# Altium project Meu Arduino.PrjPcb (part 1 of 3)
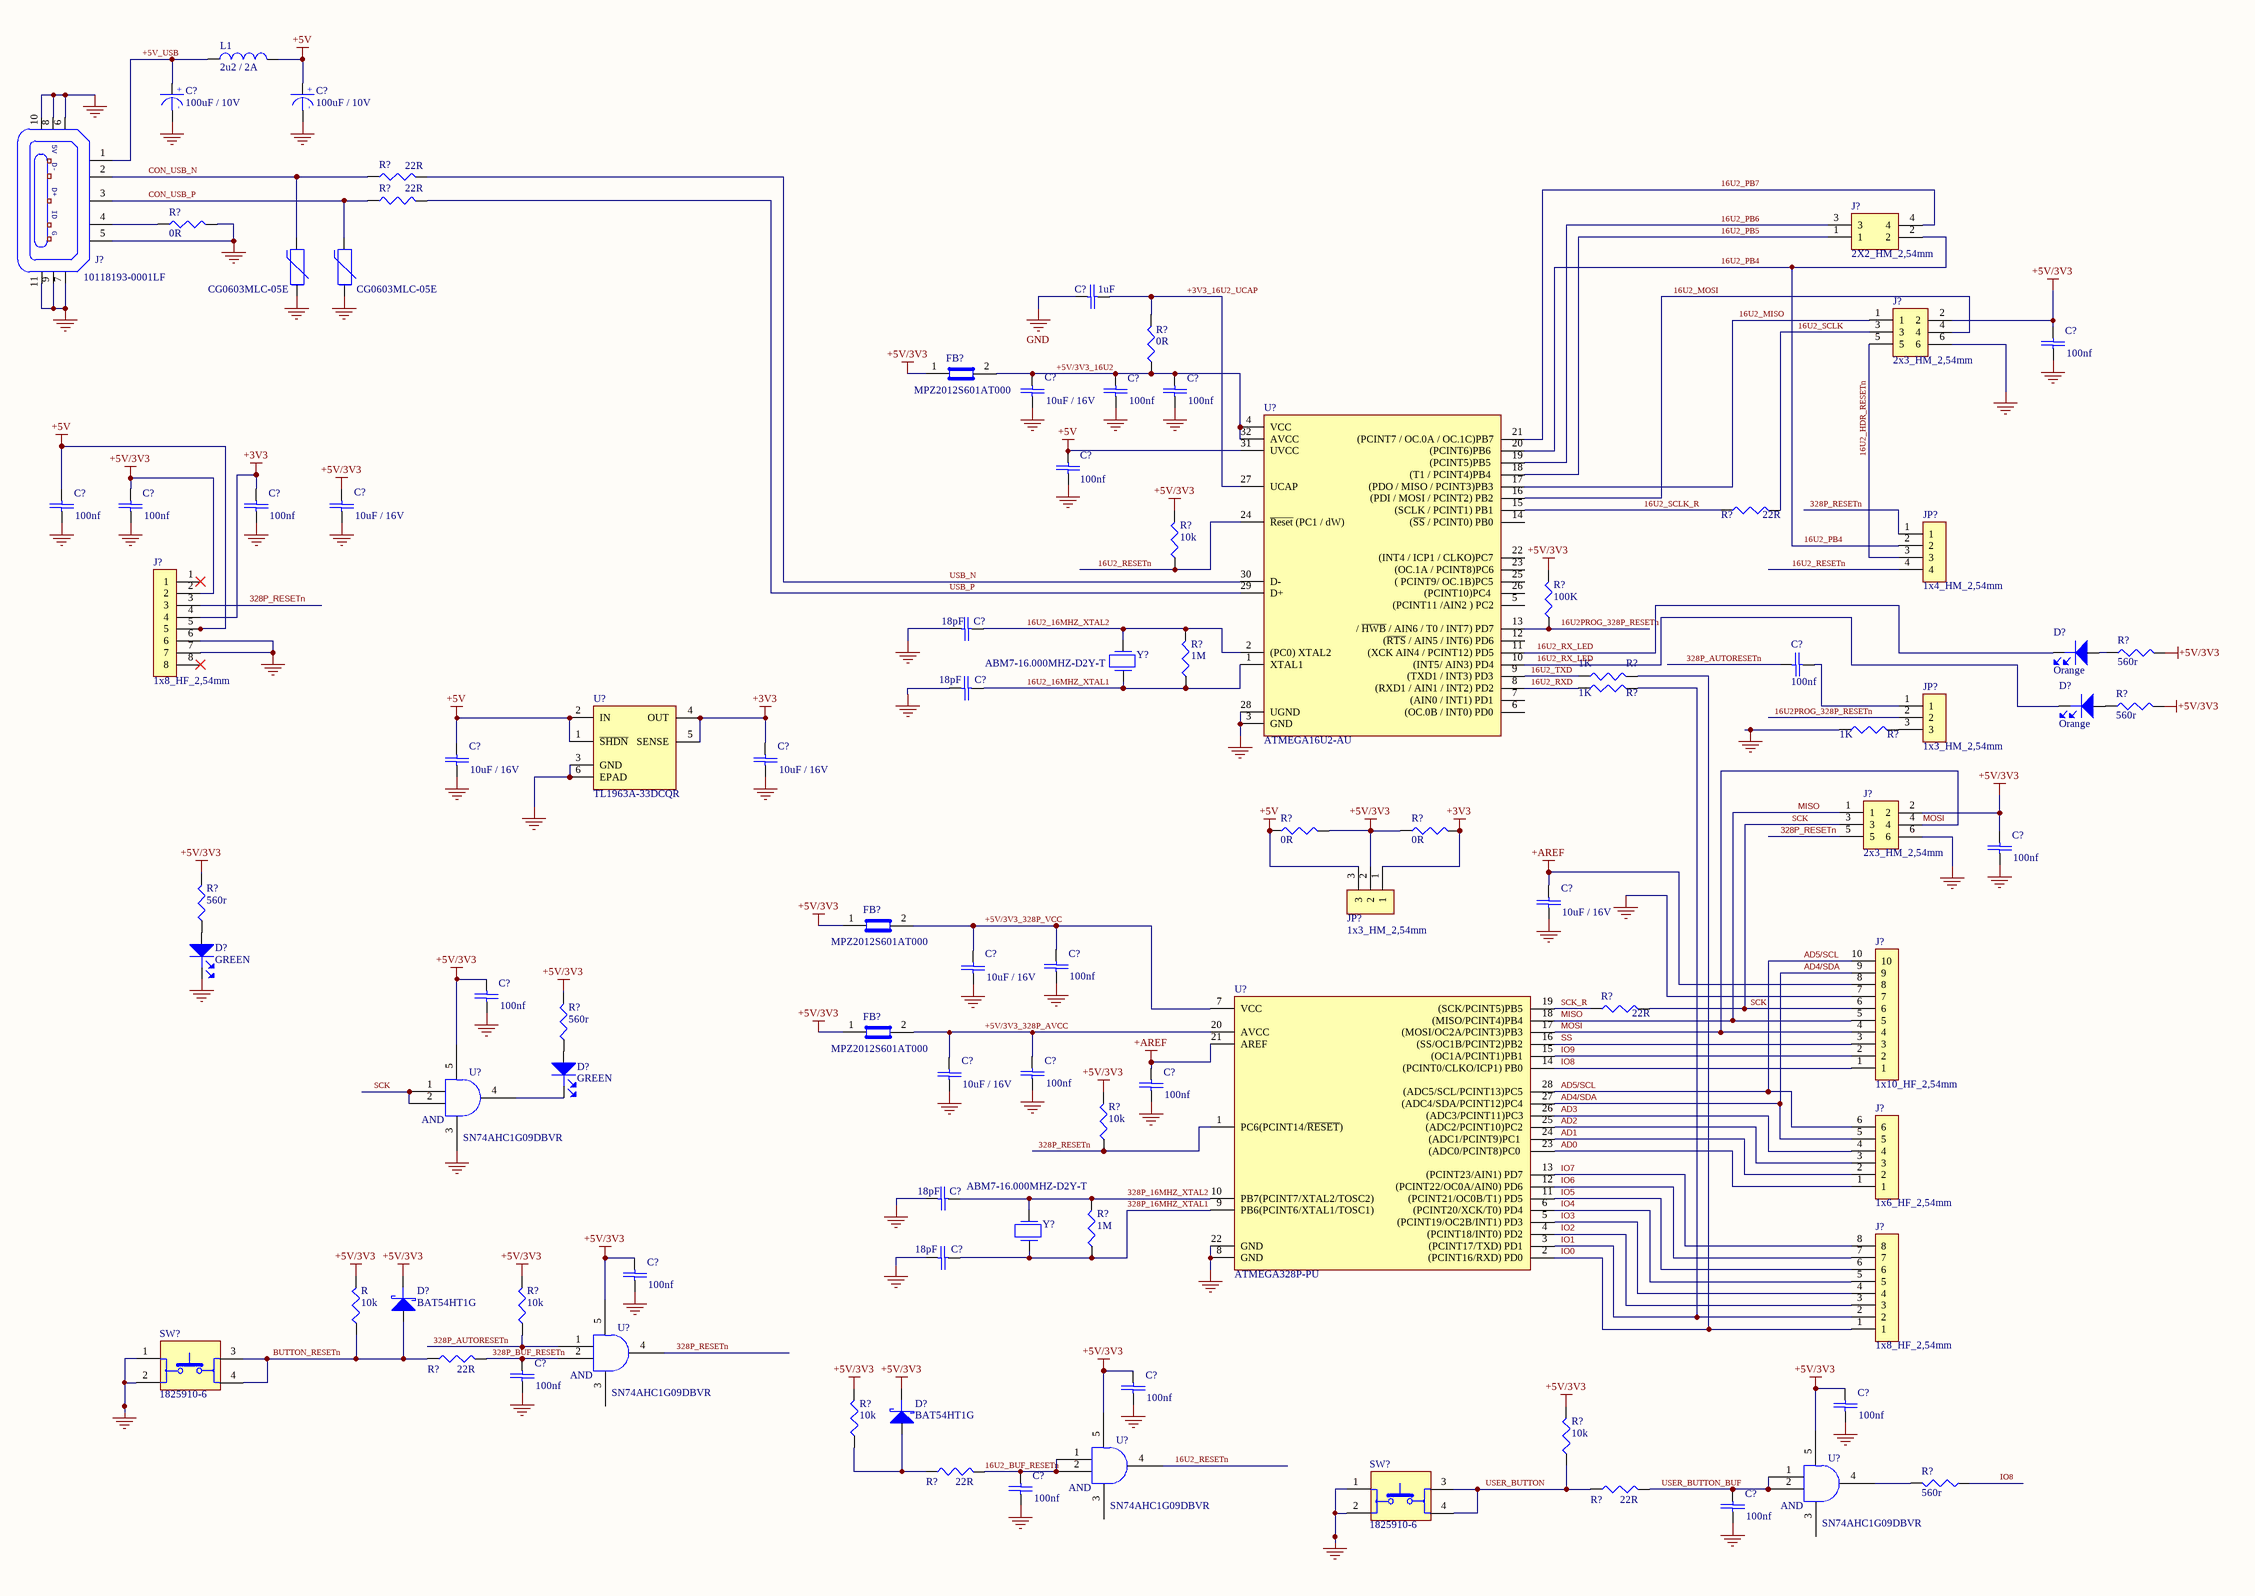
[diagram p0: Arduino Sch.SchDoc]
1 sheet, 95 parts. Net scope: global (net labels, ports and power ports of the same name join across sheets).
Board file: Arduino Pcb.PcbDoc

## Sheet Arduino Sch.SchDoc
size 566 x 398 mm; SheetNumber: 1; SheetTotal: 1

### Parts
(Parts that share a designator on the sheet are numbered #1, #2 ... from top to bottom, then left to right.)
#1  CG0603MLC-05E  [R-0603]
#2  CG0603MLC-05E  [R-0603]
C?#1  100uF / 10V  [C_ALU_C_SIZE]
C?#2  100uF / 10V  [C_ALU_C_SIZE]
C?#3  1uF  [CP-0805 10uf / 16V]
C?#4  100nf  [CP_0805]
C?#5  100nf  [CP_0805]
C?#6  100nf  [CP_0805]
C?#7  10uF / 16V  [CP-0805 10uf / 16V]
C?#8  100nf  [CP_0805]
C?#9  100nf  [CP_0805]
C?#10  100nf  [CP_0805]
C?#11  100nf  [CP_0805]
C?#12  10uF / 16V  [CP-0805 10uf / 16V]
C?#13  18pF  [CP-0805 16pF]
C?#14  100nf  [CP_0805]
C?#15  18pF  [CP-0805 16pF]
C?#16  10uF / 16V  [CP-0805 10uf / 16V]
C?#17  10uF / 16V  [CP-0805 10uf / 16V]
C?#18  100nf  [CP_0805]
C?#19  10uF / 16V  [CP-0805 10uf / 16V]
C?#20  100nf  [CP_0805]
C?#21  10uF / 16V  [CP-0805 10uf / 16V]
C?#22  100nf  [CP_0805]
C?#23  100nf  [CP_0805]
C?#24  10uF / 16V  [CP-0805 10uf / 16V]
C?#25  100nf  [CP_0805]
C?#26  18pF  [CP-0805 16pF]
C?#27  18pF  [CP-0805 16pF]
C?#28  100nf  [CP_0805]
C?#29  100nf  [CP_0805]
C?#30  100nf  [CP_0805]
C?#31  100nf  [CP_0805]
C?#32  100nf  [CP_0805]
C?#33  100nf  [CP_0805]
D?#1  Orange  [LED_Orange]
D?#2  Orange  [LED_Orange]
D?#3  GREEN  [LED_Green]
D?#4  GREEN  [LED_Green]
D?#5  BAT54HT1G  [SOD323]
D?#6  BAT54HT1G  [SOD323]
FB?#1  MPZ2012S601AT000  [CP_0805]
FB?#2  MPZ2012S601AT000  [CP_0805]
FB?#3  MPZ2012S601AT000  [CP_0805]
J?#1  10118193-0001LF
J?#2  2X2_HM_2,54mm  [Header Male 2x2 2,54mm]
J?#3  2x3_HM_2,54mm  [Header Male 2x3 2,54mm]
J?#4  1x8_HF_2,54mm  [Header Female 1x8 2.54mm]
J?#5  2x3_HM_2,54mm  [Header Male 2x3 2,54mm]
J?#6  1x10_HF_2,54mm  [Header Female 1x10 2.54mm]
J?#7  1x6_HF_2,54mm  [Header Female 1x6 2.54mm]
J?#8  1x8_HF_2,54mm  [Header Female 1x8 2.54mm]
JP?#1  1x4_HM_2,54mm  [Header Female 1x4 2.54mm]
JP?#2  1x3_HM_2,54mm  [Header Male 1x3 2.54mm]
JP?#3  1x3_HM_2,54mm  [Header Male 1x3 2.54mm]
L1  2u2 / 2A  [C_1210_IND]
R  10k  [R-1K]
R?#1  22R  [R-22]
R?#2  22R  [R-22]
R?#3  0R  [R-1K]
R?#4  0R  [R-1K]
R?#5  22R  [R-22]
R?#6  10k  [R-1K]
R?#7  100K  [R-1K]
R?#8  560r  [R-1K]
R?#9  1M  [R-1M]
R?#10  1K  [R-1K]
R?#11  1K  [R-1K]
R?#12  560r  [R-1K]
R?#13  1K  [R-1K]
R?#14  0R  [R-1K]
R?#15  0R  [R-1K]
R?#16  560r  [R-1K]
R?#17  22R  [R-22]
R?#18  560r  [R-1K]
R?#19  10k  [R-1K]
R?#20  1M  [R-1M]
R?#21  10k  [R-1K]
R?#22  22R  [R-22]
R?#23  10k  [R-1K]
R?#24  10k  [R-1K]
R?#25  22R  [R-22]
R?#26  22R  [R-22]
R?#27  560r  [R-1K]
SW?#1  1825910-6  [1825910-6]
SW?#2  1825910-6  [1825910-6]
U?#1  ATMEGA16U2-AU  [ATMEGA16U2-AU]
U?#2  TL1963A-33DCQR  [LOD-Regulator]
U?#3  ATMEGA328P-PU  [ATMEGA328P-PU]
U?#4  SN74AHC1G09DBVR  [DBV_SOP_23_5]
U?#5  SN74AHC1G09DBVR  [DBV_SOP_23_5]
U?#6  SN74AHC1G09DBVR  [DBV_SOP_23_5]
U?#7  SN74AHC1G09DBVR  [DBV_SOP_23_5]
Y?#1  ABM7-16.000MHZ-D2Y-T  [ABM7_V1_1_BIG]
Y?#2  ABM7-16.000MHZ-D2Y-T  [ABM7_V1_1_BIG]

### Nets
+3V3: C?#11.12 C?#17.12 J?#4.4 JP?#3.1 R?#15.4 U?#2.4(OUT) U?#2.5(SENSE)
+5V: C?#2.1 C?#8.12 C?#9.12 C?#16.12 J?#4.5 JP?#3.3 L1.2 R?#14.3 U?#1.31(UVCC) U?#2.1(~{SHDN}) U?#2.2(IN)
+5V/3V3: C?#4.12 C?#10.12 C?#12.12 C?#18.12 C?#22.12 C?#28.12 C?#30.12 C?#31.12 D?#5.1(KAT) D?#6.1(KAT) FB?#1.1 FB?#2.1 FB?#3.1 J?#3.2 J?#4.2 J?#5.2 JP?#3.2 R.4 R?#6.4 R?#7.4 R?#8.4 R?#12.4 R?#14.4 R?#15.3 R?#16.4 R?#18.4 R?#19.4 R?#21.4 R?#23.4 R?#24.4 U?#4.5 U?#5.5 U?#6.5 U?#7.5
+AREF: C?#19.12 C?#25.12 J?#6.8 U?#3.21(AREF)
GND: #1.1 #2.1 C?#1.2 C?#2.2 C?#3.11 C?#4.11 C?#5.11 C?#6.11 C?#7.11 C?#8.11 C?#9.11 C?#10.11 C?#11.11 C?#12.11 C?#13.11 C?#15.11 C?#16.11 C?#17.11 C?#18.11 C?#19.11 C?#20.11 C?#21.11 C?#22.11 C?#23.11 C?#24.11 C?#25.11 C?#26.11 C?#27.11 C?#28.11 C?#29.11 C?#30.11 C?#31.11 C?#32.11 C?#33.11 D?#3.1(KAT) J?#1.5 J?#1.6 J?#1.7 J?#1.8 J?#1.9 J?#1.10 J?#1.11 J?#3.6 J?#4.6 J?#4.7 J?#5.6 J?#6.7 R?#3.4 R?#13.3 SW?#1.1 SW?#1.2 SW?#2.1 SW?#2.2 U?#1.3(GND) U?#1.28(UGND) U?#2.3(GND) U?#2.6(EPAD) U?#3.8(GND) U?#3.22(GND) U?#4.3
16U2_16MHZ_XTAL1: C?#15.12 R?#9.3 U?#1.1(XTAL1) Y?#1.?1
16U2_16MHZ_XTAL2: C?#13.12 R?#9.4 U?#1.2((PC0)_XTAL2) Y?#1.?2
16U2_BUF_RESETn: C?#32.12 R?#25.4 U?#6.1 U?#6.2
16U2_HDR_RESETn: J?#3.5 JP?#1.3
16U2_MISO: J?#3.1 U?#1.17((PDO_/_MISO_/_PCINT3)PB3)
16U2_MOSI: J?#3.4 U?#1.16((PDI_/_MOSI_/_PCINT2)_PB2)
16U2_PB4: J?#2.2 JP?#1.2 U?#1.20((PCINT6)PB6)
16U2_PB5: J?#2.1 U?#1.18((T1_/_PCINT4)PB4)
16U2_PB6: J?#2.3 U?#1.19((PCINT5)PB5)
16U2_PB7: J?#2.4 U?#1.21((PCINT7_/_OC.0A_/_OC.1C)PB7)
16U2_RESETn: JP?#1.4 R?#6.3 U?#1.24(~{Reset}_(PC1_/_dW)) U?#6.4
16U2_RX_LED: D?#1.1(KAT) D?#2.1(KAT) U?#1.10((INT5/_AIN3)_PD4) U?#1.11((XCK_AIN4_/_PCINT12)_PD5)
16U2_RXD: R?#11.3 U?#1.8((RXD1_/_AIN1_/_INT2)_PD2)
16U2_SCLK: J?#3.3 R?#5.4
16U2_SCLK_R: R?#5.3 U?#1.15((SCLK_/_PCINT1)_PB1)
16U2_TXD: R?#10.3 U?#1.9((TXD1_/_INT3)_PD3)
16U2PROG_328P_RESETn: JP?#2.2 R?#7.3 U?#1.13(/_~{HWB}_/_AIN6_/_T0_/_INT7)_PD7)
328P_16MHZ_XTAL1: C?#27.12 R?#20.3 U?#3.9(PB6(PCINT6/XTAL1/TOSC1)) Y?#2.?1
328P_16MHZ_XTAL2: C?#26.12 R?#20.4 U?#3.10(PB7(PCINT7/XTAL2/TOSC2)) Y?#2.?2
328P_AUTORESETn: C?#14.12 R?#21.3 U?#5.1
328P_BUF_RESETn: C?#29.12 R?#22.4 U?#5.2
328P_RESETn: J?#4.3 J?#5.5 JP?#1.1 R?#19.3 U?#3.1(PC6(PCINT14/~{RESET})) U?#5.4
 USER_BUTTON: R?#24.3 R?#26.3 SW?#2.3 SW?#2.4
+3V3_16U2_UCAP: C?#3.12 R?#4.4 U?#1.27(UCAP)
+5V/3V3_16U2: C?#5.12 C?#6.12 C?#7.12 FB?#1.2 R?#4.3 U?#1.4(VCC) U?#1.32(AVCC)
+5V/3V3_328P_AVCC : C?#23.12 C?#24.12 FB?#3.2 U?#3.20(AVCC)
+5V/3V3_328P_VCC : C?#20.12 C?#21.12 FB?#2.2 U?#3.7(VCC)
+5V_USB: C?#1.1 J?#1.1 L1.1
AD0: J?#7.1 U?#3.23((ADC0/PCINT8)PC0)
AD1: J?#7.2 U?#3.24((ADC1/PCINT9)PC1)
AD2: J?#7.3 U?#3.25((ADC2/PCINT10)PC2)
AD3: J?#7.4 U?#3.26((ADC3/PCINT11)PC3)
AD4/SDA: J?#6.9 J?#7.5 U?#3.27((ADC4/SDA/PCINT12)PC4)
AD5/SCL: J?#6.10 J?#7.6 U?#3.28((ADC5/SCL/PCINT13)PC5)
BUTTON_RESETn: D?#5.2(ANODE) R.3 R?#22.3 SW?#1.3 SW?#1.4
CON_USB_N: #1.2 J?#1.2 R?#1.3
CON_USB_P: #2.2 J?#1.3 R?#2.3
IO0: J?#8.1 R?#10.4 U?#3.2((PCINT16/RXD)_PD0)
IO1: J?#8.2 R?#11.4 U?#3.3((PCINT17/TXD)_PD1)
IO2: J?#8.3 U?#3.4((PCINT18/INT0)_PD2)
IO3: J?#8.4 U?#3.5((PCINT19/OC2B/INT1)_PD3)
IO4: J?#8.5 U?#3.6((PCINT20/XCK/T0)_PD4)
IO5: J?#8.6 U?#3.11((PCINT21/OC0B/T1)_PD5)
IO6: J?#8.7 U?#3.12((PCINT22/OC0A/AIN0)_PD6)
IO7: J?#8.8 U?#3.13((PCINT23/AIN1)_PD7)
IO8: J?#6.1 R?#27.3 U?#3.14((PCINT0/CLKO/ICP1)_PB0)
IO9: J?#6.2 U?#3.15((OC1A/PCINT1)PB1)
MISO: J?#5.1 J?#6.5 U?#3.18((MISO/PCINT4)PB4)
MOSI: J?#5.4 J?#6.4 U?#3.17((MOSI/OC2A/PCINT3)PB3)
SCK: J?#5.3 J?#6.6 R?#17.4 U?#4.1 U?#4.2
SCK_R: R?#17.3 U?#3.19((SCK/PCINT5)PB5)
SS: J?#6.3 U?#3.16((SS/OC1B/PCINT2)PB2)
USB_N: R?#1.4 U?#1.30(D-)
USB_P: R?#2.4 U?#1.29(D+)
USER_BUTTON_BUF: C?#33.12 R?#26.4 U?#7.1 U?#7.2
NetC?#14_11: C?#14.11 JP?#2.1
NetD?#1_2: D?#1.2(ANODE) R?#8.3
NetD?#2_2: D?#2.2(ANODE) R?#12.3
NetD?#3_2: D?#3.2(ANODE) R?#16.3
NetD?#4_1: D?#4.1(KAT) U?#4.4
NetD?#4_2: D?#4.2(ANODE) R?#18.3
NetD?#6_2: D?#6.2(ANODE) R?#23.3 R?#25.3
NetJ?#1_4: J?#1.4 R?#3.3
NetJP?#2_3: JP?#2.3 R?#13.4
NetR?#27_4: R?#27.4 U?#7.4

Not connected (* = marked no-connect by the designer): J?#4 1* 8*; U?#1 5((PCINT11_/AIN2_)_PC2) 6((OC.0B_/_INT0)_PD0) 7((AIN0_/_INT1)_PD1) 12((~{RTS}_/_AIN5_/_INT6)_PD6) 14((~{SS}_/_PCINT0)_PB0) 22(_(INT4_/_ICP1_/_CLKO)PC7) 23(_(OC.1A_/_PCINT8)PC6) 25(_(_PCINT9/_OC.1B)PC5) 26((PCINT10)PC4_); U?#5 3; U?#6 3; U?#7 3